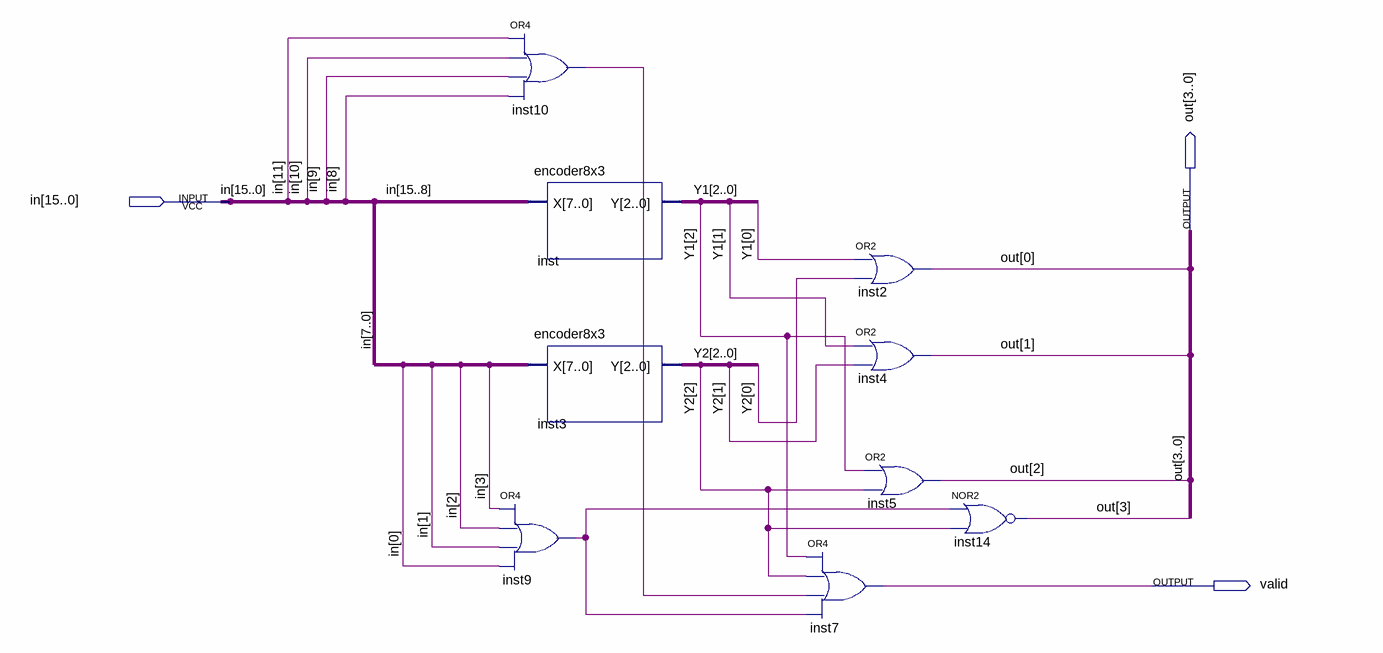
[diagram p0: schematic sheet]
// Quartus schematic Encoder16x4.bdf as structural Verilog: 9 symbols, 3 pins
module Encoder16x4 (
  input  [15:0] in,
  output [3:0] out,
  output valid
);

  wire inst9_out, inst10_out;
  wire [2:0] Y1, Y2;

  or inst10 (inst10_out, in[11], in[10], in[9], in[8]);
  encoder8x3 inst (.X(in[15:8]), .Y(Y1));
  encoder8x3 inst3 (.X(in[7:0]), .Y(Y2));
  or inst9 (inst9_out, in[3], in[2], in[1], in[0]);
  or inst2 (out[0], Y1[0], Y2[0]);
  or inst4 (out[1], Y1[1], Y2[1]);
  or inst5 (out[2], Y1[2], Y2[2]);
  or inst7 (valid, Y1[2], Y2[2], inst10_out, inst9_out);
  nor inst14 (out[3], inst9_out, Y2[2]);
endmodule
